# EAGLE schematic AS5048 Encoder (EAGLE 7.6.0)
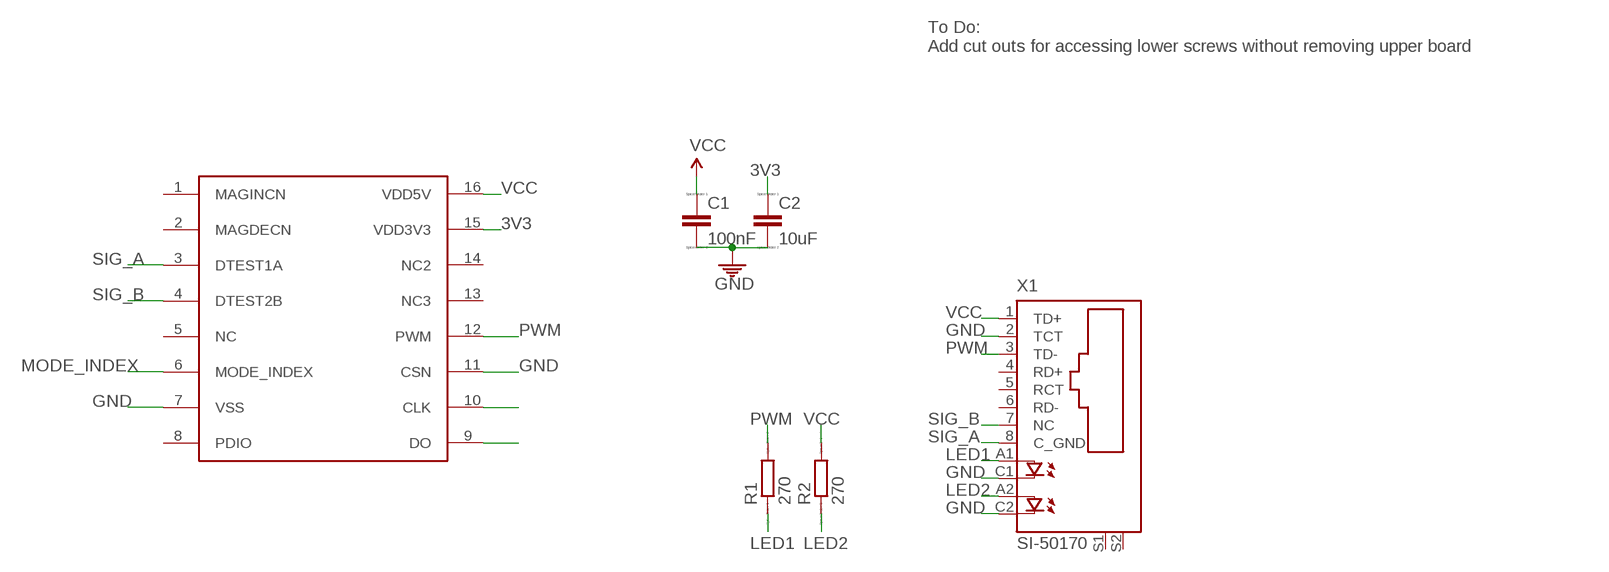
[diagram p0: schematic, sheet 1]

## Parts
C1  100nF  C  [C0805]
C2  10uF  C  [C0805]
R1  270  R  [R0805]
R2  270  R  [R0805]
U$2  AS5145  [SSOP16]
X1  SI-50170  [SI-50170]

## Nets
3V3: C2.1 U$2.15(VDD3V3)
GND: C1.2 C2.2 U$2.7(VSS) U$2.11(CSN) X1.2(TCT) X1.C1(C) X1.C2(C1)
LED1: R1.1 X1.A1(A)
LED2: R2.1 X1.A2(A1)
MODE_INDEX: U$2.6(MODE_INDEX)
N$3: U$2.10(CLK)
N$4: U$2.9(DO)
PWM: R1.2 U$2.12(PWM) X1.3(TD-)
SIG_A: U$2.3(DTEST1A) X1.8(C_GND)
SIG_B: U$2.4(DTEST2B) X1.7(NC)
VCC: C1.1 R2.2 U$2.16(VDD5V) X1.1(TD+)
Unconnected: U$2.1(MAGINCN) U$2.2(MAGDECN) U$2.5(NC) U$2.8(PDIO) U$2.13(NC3) U$2.14(NC2) X1.4(RD+) X1.5(RCT) X1.6(RD-) X1.S1 X1.S2

## Notes on the sheet
- To Do:
  Add cut outs for accessing lower screws without removing upper board

## Library data of the parts
C1 C2 = eagle-ltspice:C: CAPACITOR, European symbol; SPICEMODEL: NONE; SPICEPREFIX: C
R1 R2 = eagle-ltspice:R: RESISTOR, European symbol; SPICEMODEL: NONE; SPICEPREFIX: R
U$2 = makesmith:AS5145
X1 = con-stewart:SI-50170: Ethernet Connector MagJack (R) Source: www.stewartconnector.com .. si-50170.pdf; OC_FARNELL: unknown; OC_NEWARK: unknown